# Altium schematic sheet ADDA.SchDoc
size A4
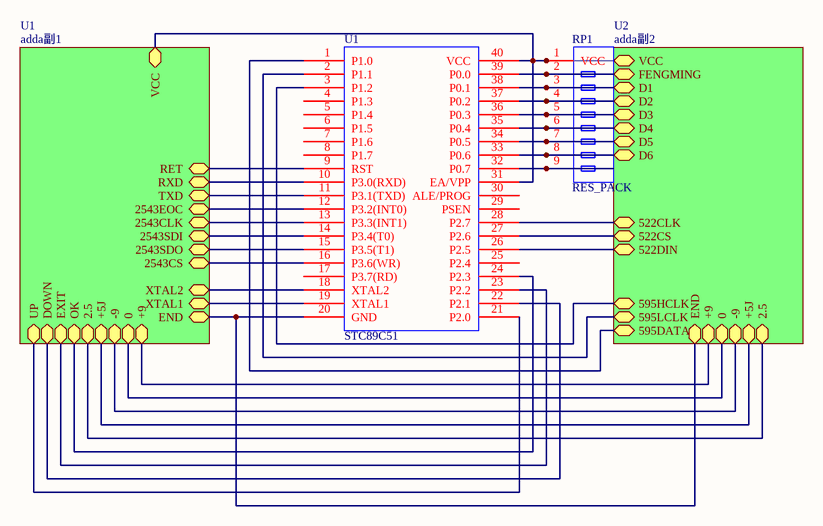
[diagram p0: ADDA.SchDoc]

## Parts
RP1  RES_PACK  [RES_PACK]
U1  STC89C51  [DIP_40]

## Sub-sheets
U1 = adda副1: RET, RXD, TXD, XTAL2, XTAL1, END, 2543SDO, 2543SDI, 2543CS, 2543CLK, 2543EOC, VCC, OK, EXIT, UP, DOWN, +9, 0, -9, +5J, 2.5
U2 = adda副2: VCC, 595HCLK, END, FENGMING, 595DATA, 595LCLK, 522DIN, 522CS, 522CLK, +9, 0, -9, +5J, 2.5, D1, D2, D3, D4, D5, D6

## Nets
NetRP1_1: RP1.1(VCC) U1.31(EA/VPP) U1.40(VCC) ; sheet U1/VCC, sheet U2/VCC
NetRP1_2: RP1.2 U1.39(P0.0) ; sheet U2/FENGMING
NetRP1_3: RP1.3 U1.38(P0.1) ; sheet U2/D1
NetRP1_4: RP1.4 U1.37(P0.2) ; sheet U2/D2
NetRP1_5: RP1.5 U1.36(P0.3) ; sheet U2/D3
NetRP1_6: RP1.6 U1.35(P0.4) ; sheet U2/D4
NetRP1_7: RP1.7 U1.34(P0.5) ; sheet U2/D5
NetRP1_8: RP1.8 U1.33(P0.6) ; sheet U2/D6
NetRP1_9: RP1.9 U1.32(P0.7)
NetU1_1: U1.1(P1.0) ; sheet U2/595DATA
NetU1_2: U1.2(P1.1) ; sheet U2/595LCLK
NetU1_3: U1.3(P1.2) ; sheet U2/595HCLK
NetU1_9: U1.9(RST) ; sheet U1/RET
NetU1_10: U1.10(P3.0(RXD)) ; sheet U1/RXD
NetU1_11: U1.11(P3.1(TXD)) ; sheet U1/TXD
NetU1_12: U1.12(P3.2(INT0)) ; sheet U1/2543EOC
NetU1_13: U1.13(P3.3(INT1)) ; sheet U1/2543CLK
NetU1_14: U1.14(P3.4(T0)) ; sheet U1/2543SDI
NetU1_15: U1.15(P3.5(T1)) ; sheet U1/2543SDO
NetU1_16: U1.16(P3.6(WR)) ; sheet U1/2543CS
NetU1_18: U1.18(XTAL2) ; sheet U1/XTAL2
NetU1_19: U1.19(XTAL1) ; sheet U1/XTAL1
NetU1_20: U1.20(GND) ; sheet U1/END, sheet U2/END
NetU1_21: U1.21(P2.0) ; sheet U1/UP
NetU1_22: U1.22(P2.1) ; sheet U1/DOWN
NetU1_23: U1.23(P2.2) ; sheet U1/EXIT
NetU1_24: U1.24(P2.3) ; sheet U1/OK
NetU1_26: U1.26(P2.5) ; sheet U2/522DIN
NetU1_27: U1.27(P2.6) ; sheet U2/522CS
NetU1_28: U1.28(P2.7) ; sheet U2/522CLK
(unnamed): sheet U1/+9, sheet U2/+9
(unnamed): sheet U1/0, sheet U2/0
(unnamed): sheet U1/-9, sheet U2/-9
(unnamed): sheet U1/+5J, sheet U2/+5J
(unnamed): sheet U1/2.5, sheet U2/2.5

Not connected (* = marked no-connect by the designer): U1 4(P1.3) 5(P1.4) 6(P1.5) 7(P1.6) 8(P1.7) 17(P3.7(RD)) 25(P2.4) 29(PSEN) 30(ALE/PROG)